# Altium schematic sheet Connectors.SchDoc
size A4; DocumentNumber: 4; SheetNumber: 4; SheetTotal: 4
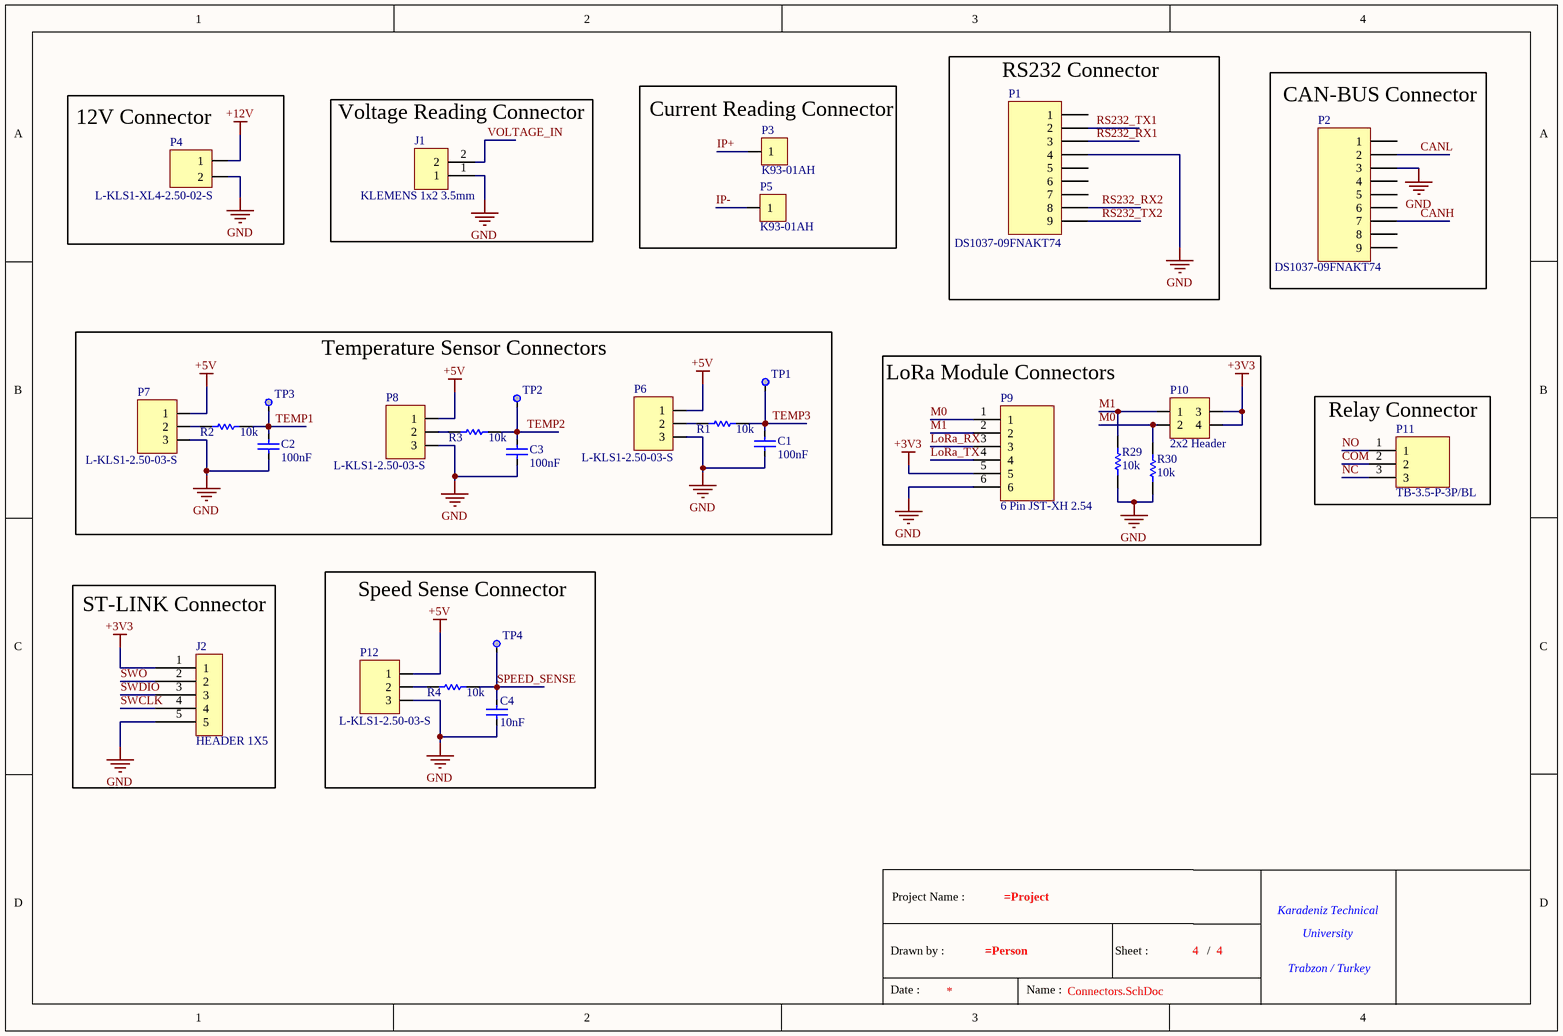
[diagram p0: Connectors.SchDoc]

## Parts
*  Title Block  (value not drawn)  (graphical)
C1  100nF  [CAP-0603]
C2  100nF  [CAP-0603]
C3  100nF  [CAP-0603]
C4  10nF  [CAP-0603]
J1  KLEMENS 1x2 3.5mm  [Klemens 1X2 3.5mm]
J2  HEADER 1X5  [Header 2.54 1x5]
P1  DS1037-09FNAKT74  [D SUB 9PIN FEMALE 90C TH]
P2  DS1037-09FNAKT74  [D SUB 9PIN FEMALE 90C TH]
P3  K93-01AH  [TERM.BLK.5.00MM BARRIER TYPE]
P4  L-KLS1-XL4-2.50-02-S  [2 PIN MALE 180C TH 2.50MM]
P5  K93-01AH  [TERM.BLK.5.00MM BARRIER TYPE]
P6  L-KLS1-2.50-03-S  [3PIN MALE 180C TH 2.5mm]
P7  L-KLS1-2.50-03-S  [3PIN MALE 180C TH 2.5mm]
P8  L-KLS1-2.50-03-S  [3PIN MALE 180C TH 2.5mm]
P9  6 Pin JST-XH 2.54  [1x6 2.50mm TUNIC CONNECTOR]
P10  2x2 Header  [2x2 Header (2.54mm)]
P11  TB-3.5-P-3P/BL  [1x3 3.50MM TERMINAL BLOCK]
P12  L-KLS1-2.50-03-S  [3PIN MALE 180C TH 2.5mm]
R1  10k  [RES-0603]
R2  10k  [RES-0603]
R3  10k  [RES-0603]
R4  10k  [RES-0603]
R29  10k  [RES-0603]
R30  10k  [RES-0603]
TP1  Test Point  [0.8mm Test Point]  (value not drawn)  (no BOM)
TP2  Test Point  [0.8mm Test Point]  (value not drawn)  (no BOM)
TP3  Test Point  [0.8mm Test Point]  (value not drawn)  (no BOM)
TP4  Test Point  [0.8mm Test Point]  (value not drawn)  (no BOM)

## Blocks framed on the sheet
Current Reading Connector: P3 P5
RS232 Connector: P1
CAN-BUS Connector: P2
12V Connector: P4
Voltage Reading Connector: J1
Temperature Sensor Connectors: C1-C3 P6-P8 R1-R3 TP1-TP3
LoRa Module Connectors: P9 P10 R29 R30
Relay Connector: P11
ST-LINK Connector: J2
Speed Sense Connector: C4 P12 R4 TP4

## Nets
+3V3: J2.1 P9.5 P10.3 P10.4
+5V: P6.1 P7.1 P8.1 P12.1
+12V: P4.1
GND: C1.1 C2.1 C3.1 C4.1 J1.1 J2.5 P1.4 P2.3 P4.2 P6.3 P7.3 P8.3 P9.6 P12.3 R29.1 R30.1
CANH: P2.7
CANL: P2.2
COM: P11.2
IP+: P3.1
IP-: P5.1
LoRa_RX: P9.3
LoRa_TX: P9.4
M0: P9.1 P10.2 R30.2
M1: P9.2 P10.1 R29.2
NC: P11.3
NO: P11.1
RS232_RX1: P1.3
RS232_RX2: P1.8
RS232_TX1: P1.2
RS232_TX2: P1.9
SPEED_SENSE: C4.2 R4.1 TP4.1
SWCLK: J2.4
SWDIO: J2.3
SWO: J2.2
TEMP1: C2.2 R2.1 TP3.1
TEMP2: C3.2 R3.1 TP2.1
TEMP3: C1.2 R1.1 TP1.1
VOLTAGE_IN: J1.2
NetP6_2: P6.2 R1.2
NetP7_2: P7.2 R2.2
NetP8_2: P8.2 R3.2
NetP12_2: P12.2 R4.2

Not connected (* = marked no-connect by the designer): P1 1 5 6 7; P2 1 4 5 6 8 9

## Notes on the sheet
- (in symbol Title Block) Project Name :; Karadeniz Technical; University; Drawn by :; Sheet :; /; Trabzon / Turkey; Date :; Name :

## Library data of the parts
* = Title Block: Standart Title Block
C1-C3 = CGA3E2X7R1H104K080AA: Manufacturer: TDK; Temperature Coefficient: X7R; Voltage: 50V; Library Reference: Capacitor; Tolerance: %10; Man Code: CGA3E2X7R1H104K080AA; Value: 100nF; Footprint: 0603; Component Type: Ceramic Capacitor
C4 = 06031C103K4T4A: Manufacturer: AVX; Temperature Coefficient: X7R; Voltage: 100V; Library Reference: Capacitor; Tolerance: %10; Man Code: 06031C103K4T4A; Value: 10nF; Footprint: 0603; Component Type: Ceramic Capacitor
J1 = KLEMENS 1x2 3.5mm: 1x2 3.5mm Klemens
J2 = HEADER 1X5: 2.54mm 1x5 Header
P1 P2 = DS1037-09FNAKT74: Manufacturer: CONNFLY; Library Reference: Connector; Mating Connector: L-KLS1-213-09-M-L; Gender: Female; Contact Number: 9; Number of Row: 2; Mounting Angle: 90; Current(max): 1.5A; Contact Resistance(max): 20mohm; Pitch: 2.77mm; Man Code: DS1037-09FNAKT74; Component Type: D SUB 9 PIN Female Connector; Mounting Style: Through Hole
P3 P5 = K93-01AH: Manufacturer: GAOSONG; Library Reference: Connector; Mating Connector: M4 Screw; Gender: Male; Contact Number: 4; Number of Row: 2; Mounting Angle: 180; Current(max): 25A; Pitch: 5-7mm; Man Code: K93-01AH; Component Type: TERM.BLK.5.00MM BARRIER TYPE; Mounting Style: Through Hole; Contact Resistance(max): -
P4 = L-KLS1-XL4-2.50-02-S: Manufacturer: KLS ELECTRONIC; Contact Number: 3; Contact Resistance (Max): 10mohm; Current(Max): 3A; Gender: Male; Mounting Angle: 180; Number of Row: 1; Pitch: 2.50mm; Component Type: CONN 2PIN MALE 180C TH 2.5mm; Mounting Style: THT; Man Code: L-KLS1-XL4-2.50-02-S
P6-P8 P12 = L-KLS1-2.50-03-S: Manufacturer: KLS ELECTRONIC; Library Reference: Connector; Mating Connector: L-KLS1-2.50-03-H; Gender: Male; Contact Number: 3; Number of Row: 1; Mounting Angle: 180; Current(max): 3A; Contact Resistance(max): 10mohm; Pitch: 2.5mm; Man Code: L-KLS1-2.50-03-S; Component Type: CONN 3PIN MALE 180C TH 2.5mm; Mounting Style: Through Hole
P9 = 6 Pin JST-XH 2.54: Manufacturer: CONNFLY; Pin Number: 6; Pitch: 2.54mm; Component Type: Connector; Number of rows: 1; Man Code: 6 Pin JST-XH 2.54; Mounting Type: THT
P10 = 2x2 Header (2.54mm): Library Reference: Connector; Gender: Male; Contact Number: 4; Number of Row: 2; Mounting Angle: 180; Pitch: 2.54mm; Man Code: 2x2 Header; Component Type: Header; Manufacturer: -; Mating Connector: -; Mounting Style: Through Hole; Current(max): -; Contact Resistance(max): -
P11 = TB-3.5-P-3P/BL: Manufacturer: NINIGI; Pitch: 3.5mm; Component Type: Connector; Man Code: TB-3.5-P-3P/BL; Number of Rows: 1; Number of Pins: 3; Mounting Type: THT
R1-R4 R29 R30 = CRCW060310K0FKEA: Manufacturer: Vishay; Tolerance: %1; Power: 0.1W; Library Reference: Resistor; Man Code: CRCW060310K0FKEA; Value: 10k; Footprint: 0603; Component Type: Chip Resistor
TP1-TP4 = Test Point: Library Reference: Miscellaneous; Component Type: Test Point